# Altium project RASP_PICO.PrjPcb
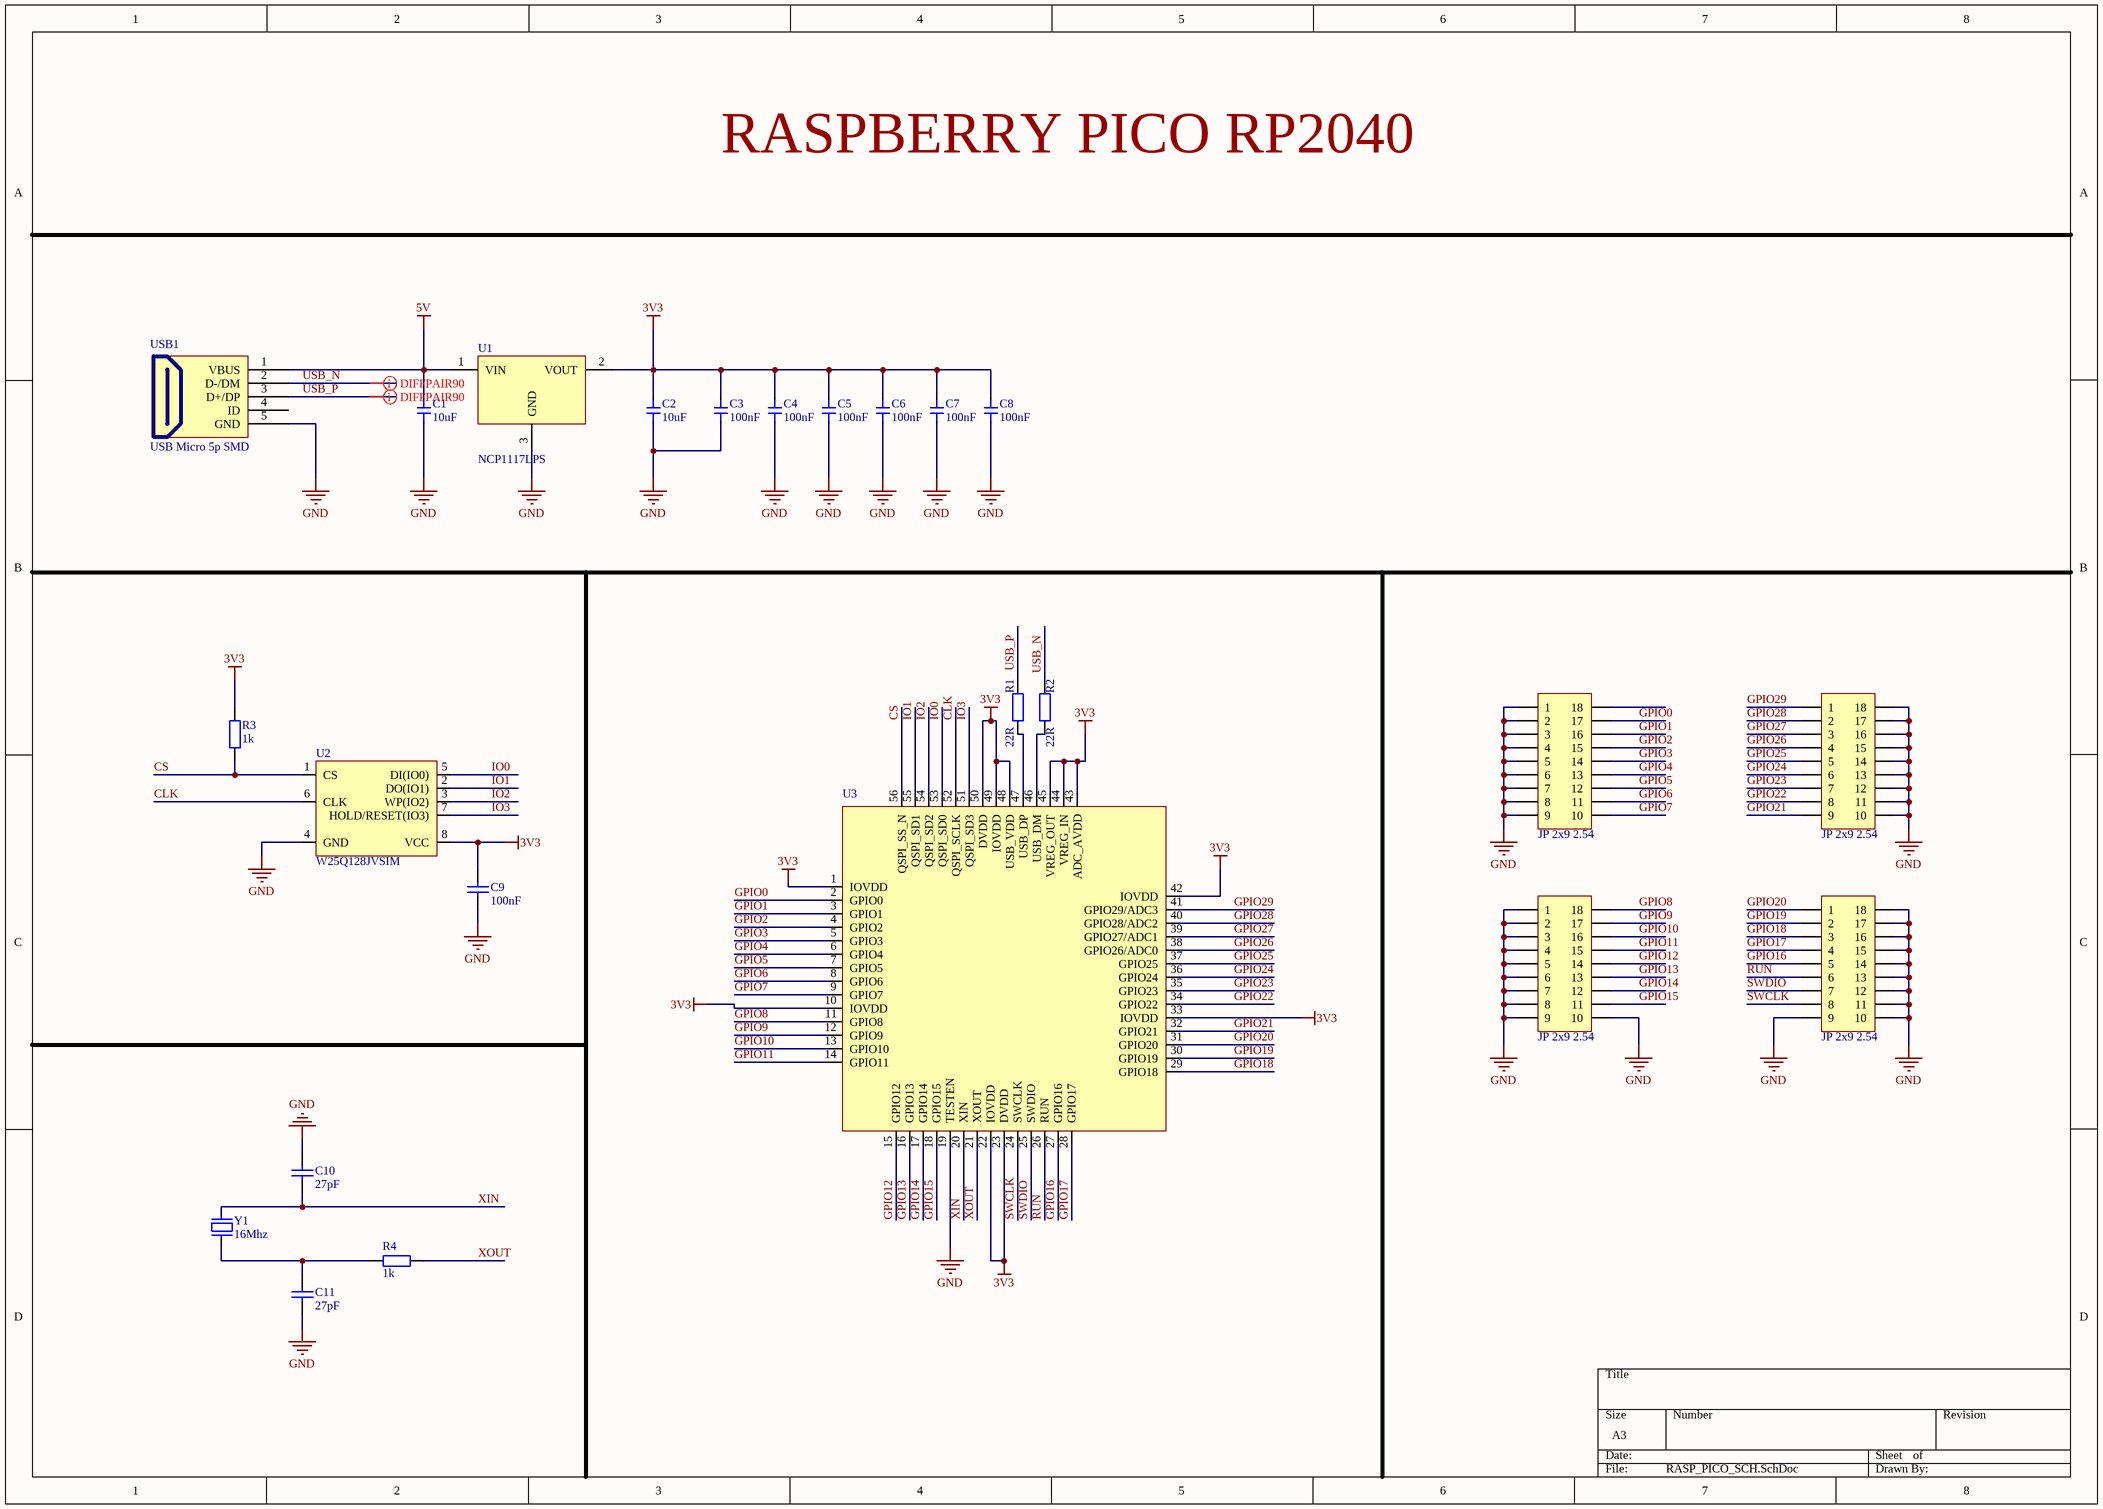
[diagram p0: RASP_PICO_SCH.SchDoc]
1 sheet, 24 parts. Net scope: global (net labels, ports and power ports of the same name join across sheets).
Board file: RASP_PICO_PCB.PcbDoc

## Sheet RASP_PICO_SCH.SchDoc
size A3; SheetNumber: 1; SheetTotal: 1

### Parts
C1  10uF  [Cap 0805]
C2  10uF  [Cap 0805]
C3  100nF  [Cap 0805]
C4  100nF  [Cap 0805]
C5  100nF  [Cap 0805]
C6  100nF  [Cap 0805]
C7  100nF  [Cap 0805]
C8  100nF  [Cap 0805]
C9  100nF  [tu 0805]
C10  27pF  [tu 0805]
C11  27pF  [tu 0805]
JP1  JP 2x9 2.54  [JP 2x9 DT]
JP2  JP 2x9 2.54  [JP 2x9 DT]
JP3  JP 2x9 2.54  [JP 2x9 DT]
JP4  JP 2x9 2.54  [JP 2x9 DT]
R1  22R  [tro smd 0805]
R2  22R  [tro smd 0805]
R3  1k  [tro smd 0805]
R4  1k  [tro smd 0805]
U1  NCP1117LPS  [SOT-223]
U2  W25Q128JVSIM  [SOIC127P790X216-8N]
U3  RP2040TR7  [QFN40P700X700X90_HS-57N]  (value not drawn)
USB1  USB Micro 5p SMD  [USB Micro 5p SMD]
Y1  16Mhz  [Thach Anh 2 chan SMD5032]

### Nets
3V3: C2.1 C3.1 C4.1 C5.1 C6.1 C7.1 C8.1 C9.1 R3.2 U1.2(VOUT) U2.8(VCC) U3.1(IOVDD) U3.10(IOVDD) U3.22(IOVDD) U3.23(DVDD) U3.33(IOVDD) U3.42(IOVDD) U3.43(ADC_AVDD) U3.44(VREG_IN) U3.45(VREG_OUT) U3.48(USB_VDD) U3.49(IOVDD) U3.50(DVDD)
5V: C1.1 U1.1(VIN) USB1.1(VBUS)
GND: C1.2 C2.2 C3.2 C4.2 C5.2 C6.2 C7.2 C8.2 C9.2 C10.1 C11.2 JP1.1 JP1.2 JP1.3 JP1.4 JP1.5 JP1.6 JP1.7 JP1.8 JP1.9 JP2.10 JP2.11 JP2.12 JP2.13 JP2.14 JP2.15 JP2.16 JP2.17 JP2.18 JP3.1 JP3.2 JP3.3 JP3.4 JP3.5 JP3.6 JP3.7 JP3.8 JP3.9 JP3.10 JP4.9 JP4.10 JP4.11 JP4.12 JP4.13 JP4.14 JP4.15 JP4.16 JP4.17 JP4.18 U1.3(GND) U2.4(GND) U3.19(TESTEN) USB1.5(GND)
CLK: U2.6(CLK) U3.52(QSPI_SCLK)
CS: R3.1 U2.1(CS) U3.56(QSPI_SS_N)
GPIO0: JP1.17 U3.2(GPIO0)
GPIO1: JP1.16 U3.3(GPIO1)
GPIO2: JP1.15 U3.4(GPIO2)
GPIO3: JP1.14 U3.5(GPIO3)
GPIO4: JP1.13 U3.6(GPIO4)
GPIO5: JP1.12 U3.7(GPIO5)
GPIO6: JP1.11 U3.8(GPIO6)
GPIO7: JP1.10 U3.9(GPIO7)
GPIO8: JP3.18 U3.11(GPIO8)
GPIO9: JP3.17 U3.12(GPIO9)
GPIO10: JP3.16 U3.13(GPIO10)
GPIO11: JP3.15 U3.14(GPIO11)
GPIO12: JP3.14 U3.15(GPIO12)
GPIO13: JP3.13 U3.16(GPIO13)
GPIO14: JP3.12 U3.17(GPIO14)
GPIO15: JP3.11 U3.18(GPIO15)
GPIO16: JP4.5 U3.27(GPIO16)
GPIO17: JP4.4 U3.28(GPIO17)
GPIO18: JP4.3 U3.29(GPIO18)
GPIO19: JP4.2 U3.30(GPIO19)
GPIO20: JP4.1 U3.31(GPIO20)
GPIO21: JP2.9 U3.32(GPIO21)
GPIO22: JP2.8 U3.34(GPIO22)
GPIO23: JP2.7 U3.35(GPIO23)
GPIO24: JP2.6 U3.36(GPIO24)
GPIO25: JP2.5 U3.37(GPIO25)
GPIO26: JP2.4 U3.38(GPIO26/ADC0)
GPIO27: JP2.3 U3.39(GPIO27/ADC1)
GPIO28: JP2.2 U3.40(GPIO28/ADC2)
GPIO29: JP2.1 U3.41(GPIO29/ADC3)
IO0: U2.5(DI(IO0)) U3.53(QSPI_SD0)
IO1: U2.2(DO(IO1)) U3.55(QSPI_SD1)
IO2: U2.3(WP(IO2)) U3.54(QSPI_SD2)
IO3: U2.7(HOLD/RESET(IO3)) U3.51(QSPI_SD3)
RUN: JP4.6 U3.26(RUN)
SWCLK: JP4.8 U3.24(SWCLK)
SWDIO: JP4.7 U3.25(SWDIO)
USB_N: R2.2 USB1.2(D-/DM)
USB_P: R1.2 USB1.3(D+/DP)
XIN: C10.2 U3.20(XIN) Y1.2
XOUT: R4.2 U3.21(XOUT)
NetC11_1: C11.1 R4.1 Y1.1
NetR1_1: R1.1 U3.47(USB_DP)
NetR2_1: R2.1 U3.46(USB_DM)

Not connected (* = marked no-connect by the designer): JP1 18; USB1 4(ID)

### Layout directives
differential pair; differential pair class diff90: USB_N, USB_P

### Notes on the sheet
- RASPBERRY PICO RP2040

### Library data of the parts
C1-C8 = Cap 0805: Capacitor SMD 0805
C9-C11 = Tu 0805 101 50V 20%: Dán; Don_Vi: Con; So_Chan: 2; Ten_Linh_Kien: Tụ 0805 101-0.1nF 50V 20%; Ma_Hang: MH002806; Chung_Loai: Dán; Kieu_Chan: *
JP1-JP4 = JP 2x9 2.54 Duc Thang: Cắm; Ten_Linh_Kien: Jump Đôi Đực 2.54MM 2x40P Thẳng 11MM; Don_Vi: Con; Ma_Hang: MH002686; Ghi_Chu: *; Kieu_Chan: *; Chung_Loai: Cắm
R1 R2 = Tro 0805 5% 22R: Dán; Don_Vi: Con; So_Chan: 2; Ten_Linh_Kien: Trở 0805 5% 22R; Ma_Hang: MH005249; Chung_Loai: Dán; Kieu_Chan: *
R3 R4 = Tro 0805 1% 1k: Dán; Don_Vi: Con; So_Chan: 2; Ten_Linh_Kien: Trở 0805 1% 1k; Ma_Hang: MH005468; Chung_Loai: Dán; Kieu_Chan: *
U1 = NCP1117LPS: IC 3V3
U2 = W25Q128JVSIM: NOR Flash Serial (SPI, Dual SPI, Quad SPI) 3V/3.3V 128M-bit 16M x 8 6ns 8-Pin SOIC Tube; Manufacturer: Winbond; Frequency: 133MHz; Max Supply Current: 20mA; Max Supply Voltage: 3.6V; Memory Size: 16MB; Min Supply Voltage: 2.7V; Number of Circuits: 1; Operating Supply Voltage: 3V; Supplier: DigiKey; Supplier Part Number: W25Q128JVSIM-ND; Manufacturer Part Number: W25Q128JVSIM; RoHS: Compliant; Category: Flash; Stock: 18270; Pricing: 1=1.97, 10=1.846, 25=1.7932, 90=1.71878, 180=1.6785, 270=1.65493, 540=1.61485, 1080=1.57507, 5040=1.48849 (USD); Ambient Temperature Range High: 85°C; China RoHS: Compliant; Height: 2.16mm; Height - Seated (Max): 2.16mm; Interface: Serial; Length: 5.23mm; Lifecycle Status: Production; Clock Frequency: 133MHz; Max Operating Temperature: 85°C; Memory Format: FLASH; Min Operating Temperature: -40°C; Number of Terminals: 8; REACH SVHC: Yes; Schedule B: 8542320070, 8542320070|8542320070, 8542320070|8542320070|8542320070, 8542320070|8542320070|8542320070|8542320070; Terminal Pitch: 1.27mm; Width: 5.23mm; ComponentLink1URL: https://datasheet.octopart.com:443/W25Q128JVSIM-Winbond-datasheet-181529389.pdf?src-supplier=ODG+(Origin+Data+Global); ComponentLink1Description: https://datasheet.octopart.com:443/W25Q128JVSIM-Winbond-datasheet-181529389.pdf?src-supplier=ODG+(Origin+Data+Global); ComponentLink2URL: https://datasheet.octopart.com:443/W25Q128JVSIM-Winbond-datasheet-138898756.pdf?src-supplier=Augswan; ComponentLink2Description: https://datasheet.octopart.com:443/W25Q128JVSIM-Winbond-datasheet-138898756.pdf?src-supplier=Augswan; ComponentLink3URL: https://sigma.octopart.com:443/138898685/technical_drawing/Winbond-W25Q128JVSIM.pdf?src-supplier=Upverter; ComponentLink3Description: https://sigma.octopart.com:443/138898685/technical_drawing/Winbond-W25Q128JVSIM.pdf?src-supplier=Upverter
USB1 = USB Micro 5p SMD: USB Type B; Ten: MicroUSB MK5P SMD; Ma_Hang: MH001020
Y1 = Thach Anh 2 chan SMD 5032: Crystal For all Crystal 2pin.; Value: 4Mhz